# EAGLE design BSS_T10 Underboard component design (EAGLE 6.5.0)
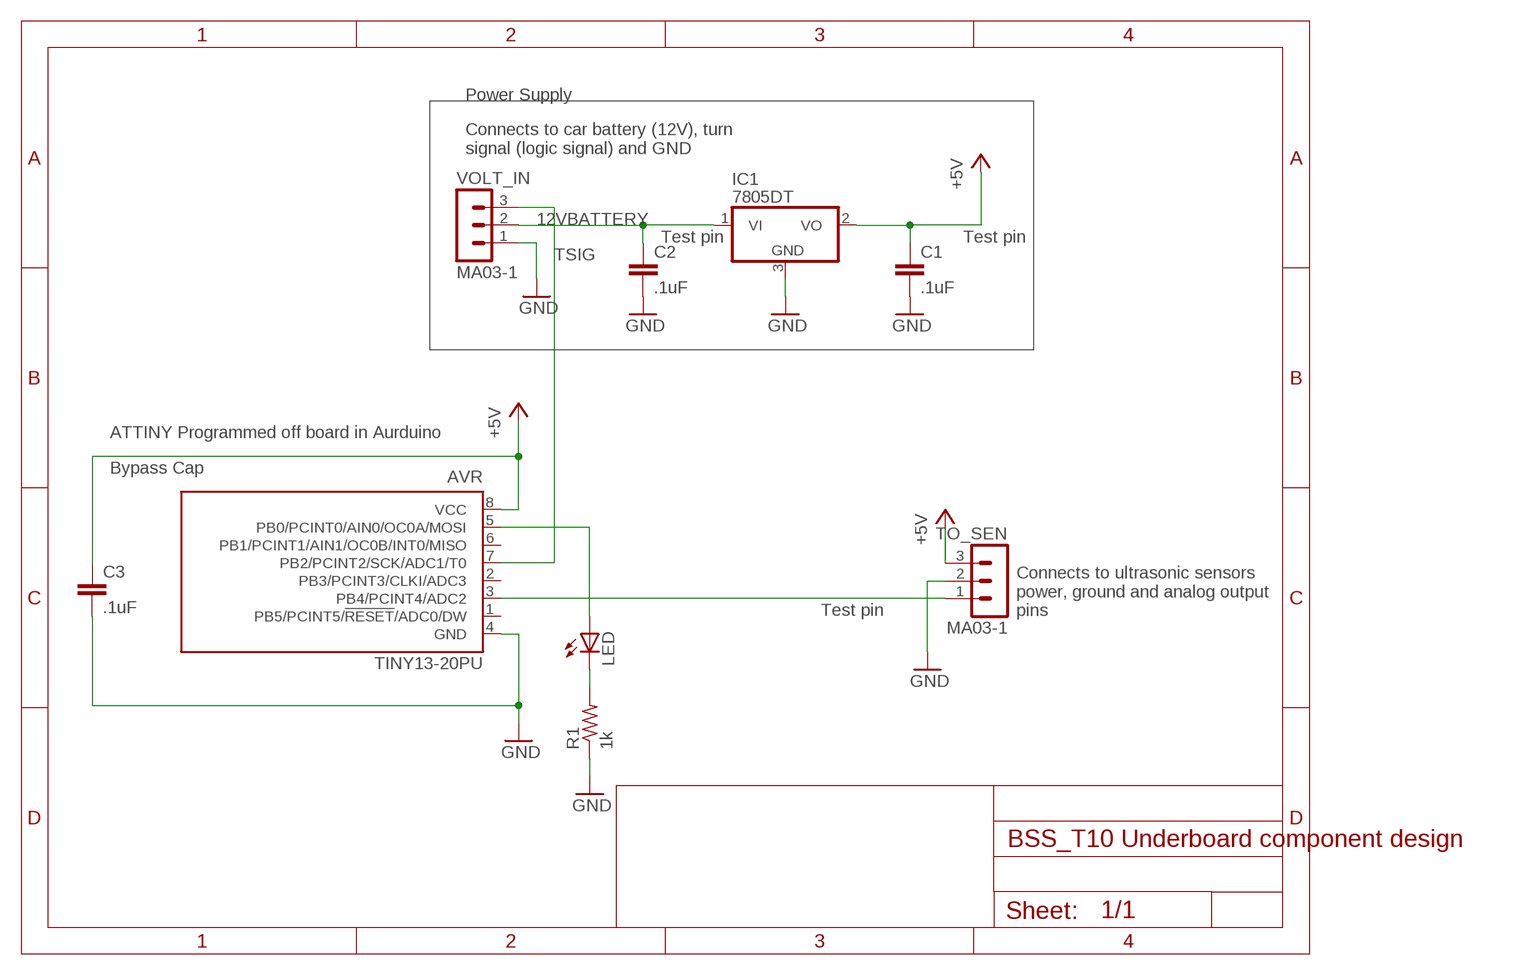
[diagram p0: schematic, sheet 1]

## Parts
AVR  TINY13-20PU  [DIL08]
C1  .1uF  C-EUC0805  [C0805]
C2  .1uF  C-EUC0805  [C0805]
C3  .1uF  C-EUC0805  [C0805]
IC1  7805DT  [TO252]
LED  LED5MM  [LED5MM]
R1  1k  R-US_R0805  [R0805]
TO_SEN  MA03-1  [MA03-1]
VOLT_IN  MA03-1  [MA03-1]

## Nets
12VBATTERY: C2.1 IC1.1(VI) VOLT_IN.2
+5V: AVR.8(VCC) C1.1 C3.1 IC1.2(VO) TO_SEN.3
GND: AVR.4(GND) C1.2 C2.2 C3.2 IC1.3(GND) R1.1 TO_SEN.2 VOLT_IN.1
N$1: AVR.3(PB4/PCINT4/ADC2) TO_SEN.1
N$4: AVR.5(PB0/PCINT0/AIN0/OC0A/MOSI) LED.A
RLED: LED.K(C) R1.2
TSIG: AVR.7(PB2/PCINT2/SCK/ADC1/T0) VOLT_IN.3
Unconnected: AVR.1(PB5/PCINT5/!RESET!/ADC0/DW) AVR.2(PB3/PCINT3/CLKI/ADC3) AVR.6(PB1/PCINT1/AIN1/OC0B/INT0/MISO)

## Notes on the sheet
- Power Supply
- Connects to car battery (12V), turn 
  signal (logic signal) and GND
- Test pin | Test pin
- ATTINY Programmed off board in Aurduino
- Bypass Cap
- Test pin
- Connects to ultrasonic sensors 
  power, ground and analog output 
  pins

## Library data of the parts
AVR = atmel:TINY13: 8-bit AVR Microcontroller with 1K Bytes In-System Programmable Flash Source: http://www.atmel.com/dyn/resources/prod_documents/2535S.pdf; MPN: ATTINY13-20PU; OC_FARNELL: 9171550; OC_NEWARK: 96K6521
C1-C3 = rcl:C-EU: CAPACITOR, European symbol
IC1 = linear:78*: Positive VOLTAGE REGULATOR Source: http://cache.national.com/ds/LM/LM78L05.pdf http://www.fairchildsemi.com/ds/LM/LM7805.pdf
LED = led:LED: LED OSRAM: - CHIPLED LG R971, LG N971, LY N971, LG Q971, LY Q971, LO R971, LY R971 LH N974, LH R974 LS Q976, LO Q976, LY Q976 LO Q996 - Hyper CHIPLED LW Q18S LB Q993, LB Q99A, LB R99A - SideLED LS A670, LO A670, LY A670, LG A670, LP A670 LB A673, LV A673, LT A673, LW A673 LH A674 LY A675 LS A676, LA A676, LO A676, LY A676, LW A676 LS A679, LY A679, LG A679 - Hyper Micro SIDELED® LS Y876, LA Y876, LO Y876, LY Y876 LT Y87S - SmartLED LW L88C, LW L88S LB L89C, LB L89S, LG L890 LS L89K, LO L89K, LY L89K LS L896, LA L896, LO L896, LY L896 - TOPLED LS T670, LO T670, LY T670, LG T670, LP T670 LSG T670, LSP T670, LSY T670, LOP T670, LYG T670 LG T671, LOG T671, LSG T671 LB T673, LV T673, LT T673, LW T673 LH T674 LS T676, LA T676, LO T676, LY T676, LB T676, LH T676, LSB T676, LW T676 LB T67C, LV T67C, LT T67C, LS T67K, LO T67K, LY T67K, LW E67C LS E67B, LA E67B, LO E67B, LY E67B, LB E67C, LV E67C, LT E67C LW T67C LS T679, LY T679, LG T679 LS T770, LO T770, LY T770, LG T770, LP T770 LB T773, LV T773, LT T773, LW T773 LH T774 LS E675, LA E675, LY E675, LS T675 LS T776, LA T776, LO T776, LY T776, LB T776 LHGB T686 LT T68C, LB T68C - Hyper Mini TOPLED® LB M676 - Mini TOPLED Santana® LG M470 LS M47K, LO M47K, LY M47K Source: http://www.osram.convergy.de LUXEON: - LUMILED® LXK2-PW12-R00, LXK2-PW12-S00, LXK2-PW14-U00, LXK2-PW14-V00 LXK2-PM12-R00, LXK2-PM12-S00, LXK2-PM14-U00 LXK2-PE12-Q00, LXK2-PE12-R00, LXK2-PE12-S00, LXK2-PE14-T00, LXK2-PE14-U00 LXK2-PB12-K00, LXK2-PB12-L00, LXK2-PB12-M00, LXK2-PB14-N00, LXK2-PB14-P00, LXK2-PB14-Q00 LXK2-PR12-L00, LXK2-PR12-M00, LXK2-PR14-Q00, LXK2-PR14-R00 LXK2-PD12-Q00, LXK2-PD12-R00, LXK2-PD12-S00 LXK2-PH12-R00, LXK2-PH12-S00 LXK2-PL12-P00, LXK2-PL12-Q00, LXK2-PL12-R00 Source: www.luxeon.com KINGBRIGHT: KA-3528ASYC Source: www.kingbright.com
R1 = rcl:R-US_: RESISTOR, American symbol
TO_SEN VOLT_IN = con-lstb:MA03-1: PIN HEADER; OC_FARNELL: unknown; OC_NEWARK: unknown

## Board
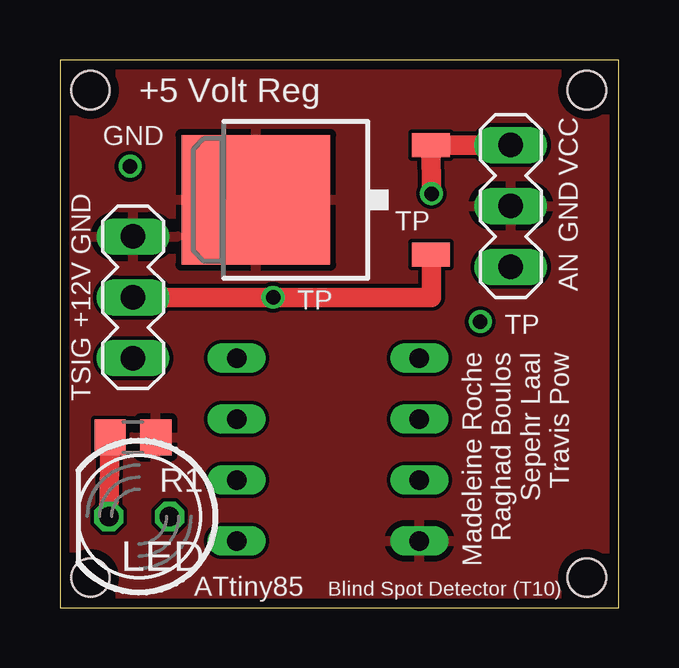
[diagram p1: board, top side]
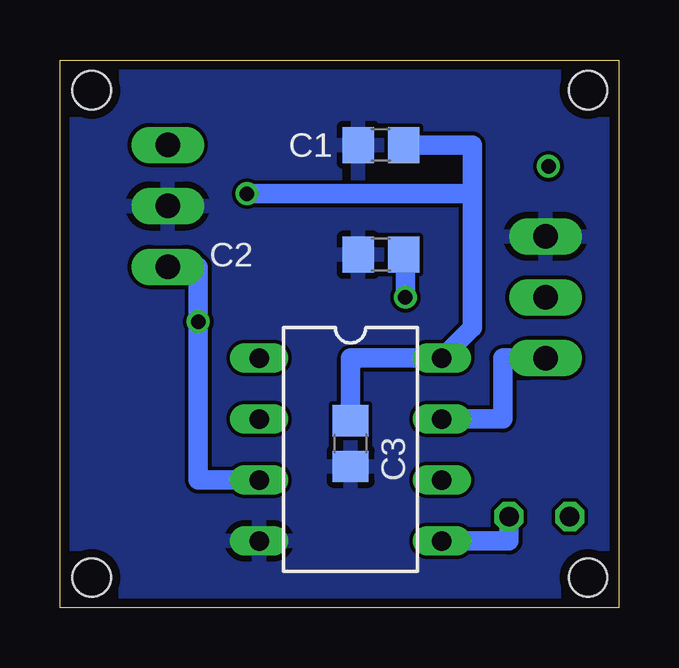
[diagram p2: board, bottom side, seen from below]

Size 23.29 x 22.85 mm. Coordinates in mm from the lower left corner, seen from the top.
Outline: 0,0 23.29,0 23.29,22.85 0,22.85 0,0
Copper layers (1*16): Top 0.0356mm / dielectric 1.5011mm / Bottom 0.0356mm
Design rules "LaenPCBOrder": minimum track width 6mil, minimum drill 13mil, track to track 6mil, track to pad 6mil, pad to pad 6mil, via to via 6mil, smd to smd 6mil, copper to edge 15mil, drill to drill 6mil, minimum pad ring 7mil, minimum via ring 7mil, stop-mask expansion 3mil, vias tented up to drill 0mil, thermal gap 10mil
Holes 1.6 mm at 1.27,1.27 1.27,21.59 21.97,21.59 21.97,1.27

### Footprints (pad centres in the part's own frame; a part is rotated, then mirrored left to right if it is on the bottom)
DIL08 = drill 0.813 long: 1 -3.81,-3.81; 2 -1.27,-3.81; 3 1.27,-3.81; 4 3.81,-3.81; 5 3.81,3.81; 6 1.27,3.81; 7 -1.27,3.81; 8 -3.81,3.81
C0805 = smd 1.3 x 1.5: 1 -0.95,0; 2 0.95,0
TO252 = smd 1 x 1.6: 1 -2.28,-4.8; 2 2.28,-4.8 | smd 5.4 x 6.2: 3 0,2.5
LED5MM = drill 0.813 octagon: A -1.27,0; K 1.27,0
R0805 = smd 1.3 x 1.5: 1 -0.95,0; 2 0.95,0
MA03-1 = drill 1.016 long: 1 -2.54,0; 2 0,0; 3 2.54,0

### Placement (x,y rotation side)
AVR  11.18,6.6 270 bottom
C1  9.91,19.3 180 bottom
C2  9.91,14.73 180 bottom
C3  11.18,6.86 270 bottom
IC1  10.67,17.02 90 top
LED  3.3,3.81 180 top
R1  3.05,7.11 180 top
TO_SEN  18.8,16.76 90 top
VOLT_IN  3.05,12.95 270 top

### Tracks (layer width: path | path; a pad name or v marks a point on that pad's centre or on a via)
12VBATTERY  (via drill 0.6)
  Top 0.813: VOLT_IN.2 v8.89,12.95 15.49,12.95 15.49,14.74 IC1.1
  Bottom 0.813: C2.1 8.89,14.73 v8.89,12.95
+5V  (via drill 0.6)
  Top 0.813: v15.49,17.27 IC1.2 TO_SEN.3
  Bottom 0.813: C1.1 6.1,19.3 6.1,17.27 | v15.49,17.27 6.1,17.27 | C3.1 11.18,10.41 AVR.8 6.1,11.68 6.1,17.27
GND
  pour Top: 0,22.86 23.37,22.86 23.37,0 0,0
  pour Bottom: 0,23.11 23.11,22.86 23.11,0 0,0.25
N$1  (via drill 0.6)
  Bottom 0.813: TO_SEN.1 17.53,14.22 v17.53,11.94 17.53,5.33 AVR.3
N$3  (via drill 0.6)
  other vias: 2.92,18.41
N$4
  Bottom 0.813: LED.A 4.57,2.79 AVR.5
RLED
  Top 0.813: LED.K R1.2
TSIG
  Bottom 0.813: VOLT_IN.3 4.83,10.41 4.83,7.87 AVR.7

### Text on the board
tNames: +5 Volt Reg | GND | VCC | TP | GND | GND | AN | TP | +12V | TP | Madeleine Roche / Raghad Boulos / Sepehr Laal / Travis Pow | TSIG | LED | ATtiny85 | Blind Spot Detector (T10)